# Altium schematic sheet TYPEB.SchDoc
size 420 x 297 mm; Формат_листа: А3
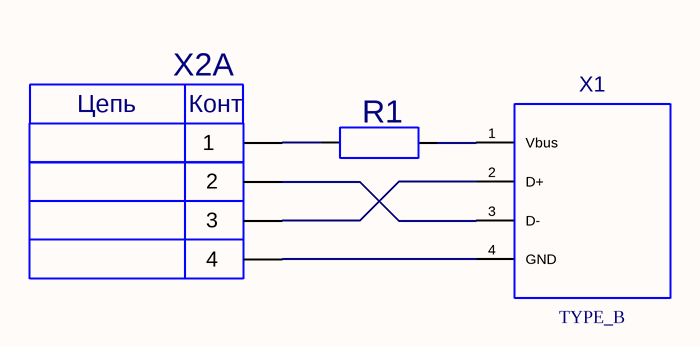
[diagram p0: TYPEB.SchDoc]

## Parts
R1  0 Ом  [R1206H07]  (value not drawn)
X1  TYPE_B  [Type_B]
X2  PLS-04  [PLS-04]  (value not drawn)  (part A of 4)

## Nets
NetR1_1: R1.1 X2.1
NetR1_2: R1.2 X1.1(Vbus)
NetX1_2: X1.2(D+) X2.3
NetX1_3: X1.3(D-) X2.2
NetX1_4: X1.4(GND) X2.4

## Notes on the sheet
- Перв.примен.
- Справ.№
- Подп. и дата
- Инв.№ дубл.
- Взам.инв.№
- Подп.и дата
- Разраб.
- Изм.
- Лист
- № докум.
- Подп.
- Дата
- Лит.
- Масштаб
- Масса
- Т.контр.
- Пров.
- Листов
- Инв.№ подл.
- Утв.
- Н.контр.
- Копировал
- Формат
- (in symbol PLS-04, part A) Цепь; Конт

## Library data of the parts
R1 = R1206 0Ohm_5: Постоянный ЧИП резистор; Part Number: 1206 0 Ом±5%; Power: 0.25W; TemperatureOperating_max: 155; TemperatureOperating_min: -55; Tolerance: ±5%; Value: 0Оhm; FullName: Резистор 1206 0 Ом±5%; ID: R1206 0Ohm_5; ComponentLink1Description: Ссылка на сайт производителя; ComponentLink2Description: Ссылка на сайт производителя; ComponentLink3Description: Ссылка на сайт производителя; HelpURL: D:\Local_view\PDM\Справочники\Перечень ЭРИ\Документация\Резисторы\Постоянные\ЧИП\RC1206_yageo.pdf; Mounting: SMT; Package: 1206; PackageType: RES-CHIP; Type: Резистор
X1 = USB_type_B: Manufacturer: Texas Instruments; ValueBOM: Микросхема TYPE_B Texas Instruments; DType: Микросхема; ComponentLink1Description: Datasheet; ComponentLink1URL: c:\Dataseets\Микросхемы\По фирмам\Avago Technologies\HCPL-4100.pdf; Package: SOT23-6; ValueSch: TYPE_B
X2 = PLS-04: Вилка на плату прямая шаг 2,54 мм 1 ряд; Current: 1А; TemperatureOperating_max: 105; TemperatureOperating_min: -25; Voltage_max: 250V; FullName: Вилка PLS-04; ID: PLS-04; ComponentLink1Description: Ссылка на сайт производителя; ComponentLink2Description: Ссылка на сайт производителя; ComponentLink3Description: Ссылка на сайт производителя; HelpURL: D:\Local_view\PDM\Справочники\Перечень ЭРИ\Документация\Соединители\Прямоугольные\pld_pls.pdf; Mounting: THT; Package: PLS-04; PackageType: CON-PLD; Part Number: PLS-04; Type: Вилка